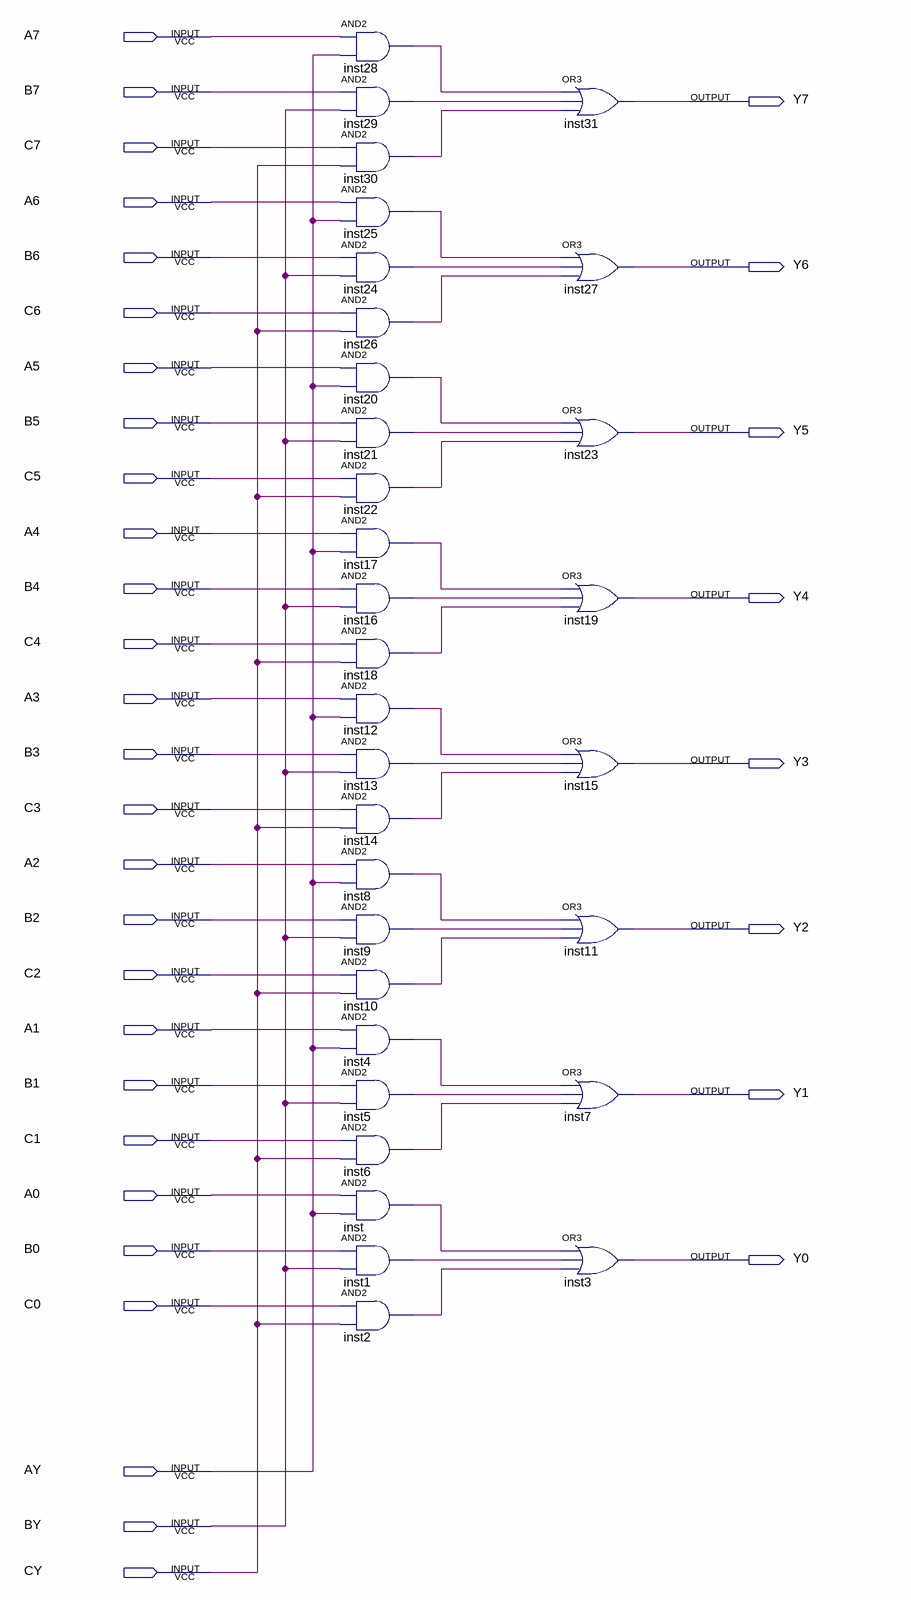
[diagram p0: schematic sheet]
// Quartus schematic triple_selector_8b.bdf as structural Verilog: 32 symbols, 35 pins
module triple_selector_8b (
  input  A7,
  input  B7,
  input  C7,
  input  A6,
  input  B6,
  input  C6,
  input  A5,
  input  B5,
  input  C5,
  input  A4,
  input  B4,
  input  C4,
  input  A3,
  input  B3,
  input  C3,
  input  A2,
  input  B2,
  input  C2,
  input  A1,
  input  B1,
  input  C1,
  input  A0,
  input  B0,
  input  C0,
  input  AY,
  input  BY,
  input  CY,
  output Y7,
  output Y6,
  output Y5,
  output Y4,
  output Y3,
  output Y2,
  output Y1,
  output Y0
);

  wire inst1_out, inst2_out, inst4_out, inst5_out, inst6_out, inst8_out, inst9_out, inst10_out, inst12_out,
       inst13_out, inst14_out, inst16_out, inst17_out, inst18_out, inst20_out, inst21_out, inst22_out,
       inst24_out, inst25_out, inst26_out, inst28_out, inst29_out, inst30_out, inst_out;

  and inst28 (inst28_out, A7, AY);
  and inst29 (inst29_out, B7, BY);
  and inst30 (inst30_out, C7, CY);
  and inst25 (inst25_out, A6, AY);
  and inst24 (inst24_out, B6, BY);
  and inst26 (inst26_out, C6, CY);
  and inst20 (inst20_out, A5, AY);
  and inst21 (inst21_out, B5, BY);
  and inst22 (inst22_out, C5, CY);
  and inst17 (inst17_out, A4, AY);
  and inst16 (inst16_out, B4, BY);
  and inst18 (inst18_out, C4, CY);
  and inst12 (inst12_out, A3, AY);
  and inst13 (inst13_out, B3, BY);
  and inst14 (inst14_out, C3, CY);
  and inst8 (inst8_out, A2, AY);
  and inst9 (inst9_out, B2, BY);
  and inst10 (inst10_out, C2, CY);
  and inst4 (inst4_out, A1, AY);
  and inst5 (inst5_out, B1, BY);
  and inst6 (inst6_out, C1, CY);
  and inst (inst_out, A0, AY);
  and inst1 (inst1_out, B0, BY);
  and inst2 (inst2_out, C0, CY);
  or inst31 (Y7, inst28_out, inst29_out, inst30_out);
  or inst27 (Y6, inst25_out, inst24_out, inst26_out);
  or inst23 (Y5, inst20_out, inst21_out, inst22_out);
  or inst19 (Y4, inst17_out, inst16_out, inst18_out);
  or inst15 (Y3, inst12_out, inst13_out, inst14_out);
  or inst11 (Y2, inst8_out, inst9_out, inst10_out);
  or inst7 (Y1, inst4_out, inst5_out, inst6_out);
  or inst3 (Y0, inst_out, inst1_out, inst2_out);
endmodule
